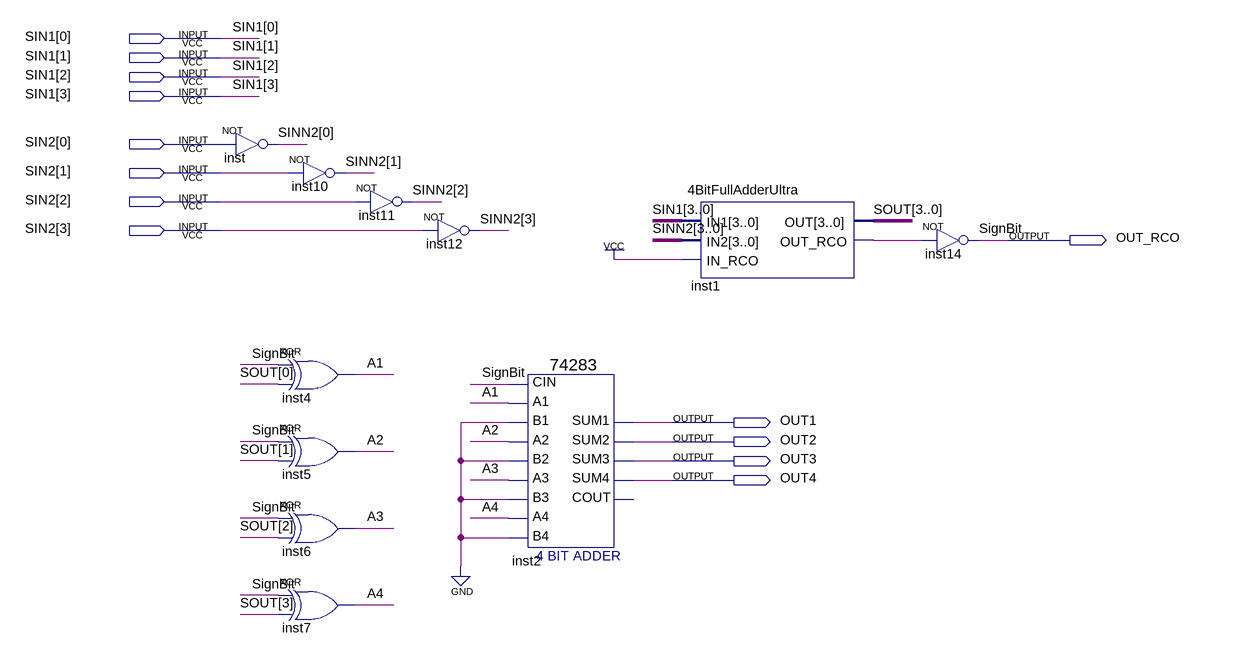
[diagram p0: schematic sheet]
// Quartus schematic 4BitFullSubtractor.bdf as structural Verilog: 11 symbols, 13 pins
module \4BitFullSubtractor  (
  input  [3:0] SIN1,
  input  [3:0] SIN2,
  output OUT_RCO,
  output OUT1,
  output OUT2,
  output OUT3,
  output OUT4
);

  wire A1, A2, A3, A4, inst1_out_rco;
  wire [3:0] SINN2, SOUT;

  not inst (SINN2[0], SIN2[0]);
  not inst10 (SINN2[1], SIN2[1]);
  xor inst4 (A1, OUT_RCO, SOUT[0]);
  xor inst5 (A2, OUT_RCO, SOUT[1]);
  xor inst6 (A3, OUT_RCO, SOUT[2]);
  xor inst7 (A4, OUT_RCO, SOUT[3]);
  not inst11 (SINN2[2], SIN2[2]);
  not inst12 (SINN2[3], SIN2[3]);
  \74283  inst2 (
    .CIN(OUT_RCO), .A1(A1), .A2(A2), .B2(1'b0), .A3(A3), .A4(A4), .B4(1'b0), .B1(1'b0), .B3(1'b0),
    .SUM4(OUT4), .SUM1(OUT1), .SUM2(OUT2), .SUM3(OUT3));  // open: COUT
  \4BitFullAdderUltra  inst1 (.IN1(SIN1), .IN2(SINN2), .IN_RCO(1'b1), .OUT(SOUT), .OUT_RCO(inst1_out_rco));
  not inst14 (OUT_RCO, inst1_out_rco);

  // Other names for the same wires on the sheet: SignBit = OUT_RCO
endmodule
